# EAGLE design Frienduino (EAGLE 6.5.0)
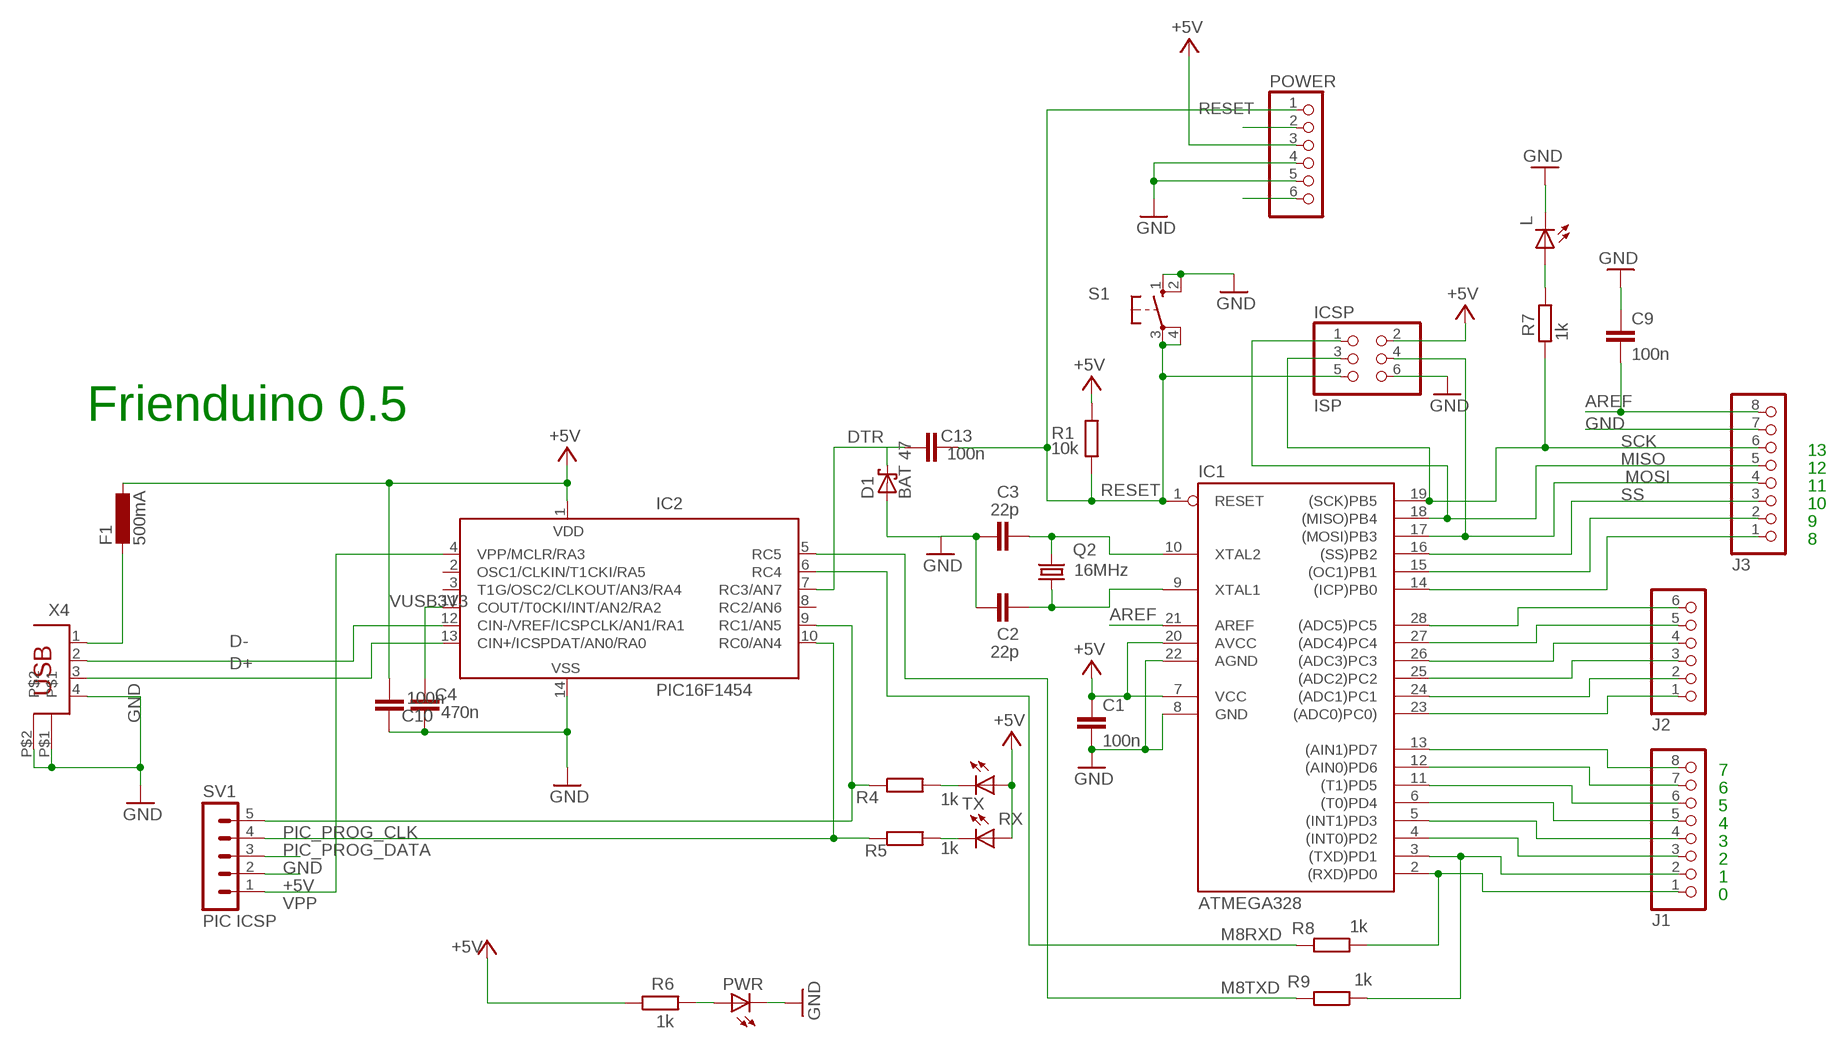
[diagram p0: schematic, sheet 1]

## Parts
C1  100n  C-EU050-025X075  [C050-025X075]
C2  22p  C-EU050-024X044  [C050-024X044]
C3  22p  C-EU050-024X044  [C050-024X044]
C4  470n  C-EU050-025X075  [C050-025X075]
C9  100n  C-EU050-025X075  [C050-025X075]
C10  100n  C-EU050-025X075  [C050-025X075]
C13  100n  C-EU050-025X075  [C050-025X075]
D1  BAT 47  SCHOTTKY-DIODEDO35-7  [DO35-7]
F1  500mA  L-EU0204/5  [0204/5]
IC1  ATMEGA328  AT90S4433P  [DIL28-3]
IC2  PIC16F1454  PIC16F676P  [DIL14]
ICSP  ISP  PINHD-2X3  [2X03]
J1  PINHD-1X8  [1X08]
J2  PINHD-1X6  [1X06]
J3  PINHD-1X8  [1X08]
L  LED3MM  [LED3MM]
POWER  PINHD-1X6  [1X06]
PWR  LED3MM  [LED3MM]
Q2  16MHz  CRYTALHC49S  [HC49/S]
R1  10k  R-EU_0204/7  [0204/7]
R4  1k  R-EU_0204/7  [0204/7]
R5  1k  R-EU_0204/7  [0204/7]
R6  1k  R-EU_0204/7  [0204/7]
R7  1k  R-EU_0204/7  [0204/7]
R8  1k  R-EU_0204/7  [0204/7]
R9  1k  R-EU_0204/7  [0204/7]
RX  LED3MM  [LED3MM]
S1  10-XX  [B3F-10XX]
SV1  PIC ICSP  MA05-1  [MA05-1]
TX  LED3MM  [LED3MM]
X4  PN61729  [PN61729]

## Nets
+5V [usbvcc]: C1.1 C10.1 F1.1 IC1.7(VCC) IC1.20(AVCC) IC2.1(VDD) ICSP.2 POWER.3 R1.2 R6.1 RX.A SV1.2 TX.A
AREF [aref]: C9.2 IC1.21(AREF) J3.8
D+: IC2.13(CIN+/ICSPDAT/AN0/RA0) X4.3
D-: IC2.12(CIN-/VREF/ICSPCLK/AN1/RA1) X4.2
DTR: C13.1 D1.C IC2.7(RC3/AN7)
GND [gnd]: C1.2 C2.1 C3.1 C4.1 C9.1 C10.2 D1.A IC1.8(GND) IC1.22(AGND) IC2.14(VSS) ICSP.6 J3.7 L.K(C) POWER.4 POWER.5 PWR.K(C) S1.1(S) S1.2(S1) SV1.3 X4.4 X4.P$1 X4.P$2
M8RXD: IC2.6(RC4) R8.2
M8TXD: IC2.5(RC5) R9.2
MISO: IC1.18((MISO)PB4) ICSP.1 J3.5
MOSI: IC1.17((MOSI)PB3) ICSP.4 J3.4
N$2: L.A R7.1
N$3: PWR.A R6.2
N$4: R4.2 TX.K(C)
N$5: IC1.14((ICP)PB0) J3.1
N$6: C2.2 IC1.9(XTAL1) Q2.1
N$7: C3.2 IC1.10(XTAL2) Q2.2
N$8 [usbvcc]: F1.2 X4.1
N$9: R5.2 RX.K(C)
N$10: IC1.4((INT0)PD2) J1.3
N$11: IC1.5((INT1)PD3) J1.4
N$12: IC1.6((T0)PD4) J1.5
N$13: IC1.11((T1)PD5) J1.6
N$14: IC1.12((AIN0)PD6) J1.7
N$15: IC1.13((AIN1)PD7) J1.8
N$16: IC1.23((ADC0)PC0)) J2.1
N$17: IC1.24((ADC1)PC1) J2.2
N$18: IC1.25((ADC2)PC2) J2.3
N$19: IC1.26((ADC3)PC3) J2.4
N$20: IC1.27((ADC4)PC4) J2.5
N$21: IC1.28((ADC5)PC5) J2.6
N$22: IC1.15((OC1)PB1) J3.2
NC@1: POWER.2
NC@2: POWER.6
PD0: IC1.2((RXD)PD0) J1.1 R8.1
PD1: IC1.3((TXD)PD1) J1.2 R9.1
PIC_PROG_CLK: IC2.9(RC1/AN5) R4.1 SV1.5
PIC_PROG_DATA: IC2.10(RC0/AN4) R5.1 SV1.4
RESET: C13.2 IC1.1(RESET) ICSP.5 POWER.1 R1.1 S1.3(P) S1.4(P1)
SCK: IC1.19((SCK)PB5) ICSP.3 J3.6 R7.2
SS: IC1.16((SS)PB2) J3.3
VPP: IC2.4(VPP/MCLR/RA3) SV1.1
VUSB3V3: C4.2 IC2.11(COUT/T0CKI/INT/AN2/RA2)
Unconnected: IC2.2(OSC1/CLKIN/T1CKI/RA5) IC2.3(T1G/OSC2/CLKOUT/AN3/RA4) IC2.8(RC2/AN6)

## Notes on the sheet
- Frienduino 0.5
- 13
- 12
- 11
- 10
- 9
- 8
- 7
- 6
- 5
- 4
- 3
- 2
- 1
- 0

## Library data of the parts
C1-C4 C9 C10 C13 = rcl:C-EU: CAPACITOR, European symbol
D1 = diode:SCHOTTKY-DIODE: Schottky Diode
F1 = rcl:L-EU: INDUCTOR, European symbol
IC1 = atmel:AT90S4433: MICROCONTROLLER 4 Kbytes FLASH 128 bytes SRAM 256 bytes EEPROM UART 6-channel 10 bit ADC
IC2 = microchip:PIC16F676: 14-Pin, Flash-Based 8-Bit CMOS Microcontroller High Performance RISC CPU: * Only 35 instructions to learn - All single-cycle instructions except branches * Operating speed: - DC - 20 MHz oscillator/clock input - DC - 200 ns instruction cycle * Internal and external oscillator options - Precision Internal 4 MHz oscillator factory calibrated to ±1% - External Oscillator support for crystals and resonators - 5?s wake-up from SLEEP, 3.0V, typical * Power saving SLEEP mode * Wide operating voltage range - 2.0V to 5.5V * Industrial and Extended temperature range * Low power Power-on Reset (POR) * Power-up Timer (PWRT) and Oscillator Start-up Timer (OST) * Brown-out Detect (BOD) * Watchdog Timer (WDT) with independent oscillator for reliable operation * Multiplexed MCLR/Input-pin * Interrupt-on-pin change * Individual programmable weak pull-ups * Programmable code protection * High Endurance FLASH/EEPROM Cell - 100,000 write FLASH endurance - 1,000,000 write EEPROM endurance - FLASH/Data EEPROM Retention: > 40 years * Standby Current: - 1 nA @ 2.0V, typical * Operating Current: - 8.5?A @ 32 kHz, 2.0V, typical - 100?A @ 1 MHz, 2.0V, typical * Watchdog Timer Current - 300 nA @ 2.0V, typical * Timer1 oscillator current: - 4?A @ 32 kHz, 2.0V, typical * 12 I/O pins with individual direction control * High current sink/source for direct LED drive * Analog-to-Digital Converter module (PIC16F676): - 10-bit resolution - Programmable 8-channel input - Voltage reference input * In-Circuit Serial ProgrammingTM (ICSPTM) via two pins Source: http://ww1.microchip.com/downloads/en/DeviceDoc/40039E.pdf; MF: MICROCHIP; MPN: PIC16F676-I/P; OC_FARNELL: 9760512; OC_NEWARK: 54K2829
ICSP = pinhead:PINHD-2X3: PIN HEADER
J1 J3 = pinhead:PINHD-1X8: PIN HEADER
J2 POWER = pinhead:PINHD-1X6: PIN HEADER
L PWR RX TX = led:LED: LED OSRAM: - CHIPLED LG R971, LG N971, LY N971, LG Q971, LY Q971, LO R971, LY R971 LH N974, LH R974 LS Q976, LO Q976, LY Q976 LO Q996 - Hyper CHIPLED LW Q18S LB Q993, LB Q99A, LB R99A - SideLED LS A670, LO A670, LY A670, LG A670, LP A670 LB A673, LV A673, LT A673, LW A673 LH A674 LY A675 LS A676, LA A676, LO A676, LY A676, LW A676 LS A679, LY A679, LG A679 - Hyper Micro SIDELED® LS Y876, LA Y876, LO Y876, LY Y876 LT Y87S - SmartLED LW L88C, LW L88S LB L89C, LB L89S, LG L890 LS L89K, LO L89K, LY L89K LS L896, LA L896, LO L896, LY L896 - TOPLED LS T670, LO T670, LY T670, LG T670, LP T670 LSG T670, LSP T670, LSY T670, LOP T670, LYG T670 LG T671, LOG T671, LSG T671 LB T673, LV T673, LT T673, LW T673 LH T674 LS T676, LA T676, LO T676, LY T676, LB T676, LH T676, LSB T676, LW T676 LB T67C, LV T67C, LT T67C, LS T67K, LO T67K, LY T67K, LW E67C LS E67B, LA E67B, LO E67B, LY E67B, LB E67C, LV E67C, LT E67C LW T67C LS T679, LY T679, LG T679 LS T770, LO T770, LY T770, LG T770, LP T770 LB T773, LV T773, LT T773, LW T773 LH T774 LS E675, LA E675, LY E675, LS T675 LS T776, LA T776, LO T776, LY T776, LB T776 LHGB T686 LT T68C, LB T68C - Hyper Mini TOPLED® LB M676 - Mini TOPLED Santana® LG M470 LS M47K, LO M47K, LY M47K Source: http://www.osram.convergy.de/
Q2 = crystal:CRYTAL: CRYSTAL
R1 R4-R9 = resistor:R-EU_: RESISTOR, European symbol
S1 = switch-omron:10-XX: OMRON SWITCH
SV1 = con-lstb:MA05-1: PIN HEADER; OC_FARNELL: unknown; OC_NEWARK: unknown
X4 = SmartPrj:PN61729: BERG USB connector

## Net classes
0 default: width 0.254 mm, drill 0.305 mm, clearance 0.152 mm
1 power: width 0.406 mm, drill 0.508 mm, clearance 0.152 mm
2 gnd: width 0.305 mm, drill 0.508 mm, clearance 0.152 mm
3 usbvcc: width 0.406 mm, drill 0.508 mm, clearance 0.152 mm
4 aref: width 0.406 mm

## Board
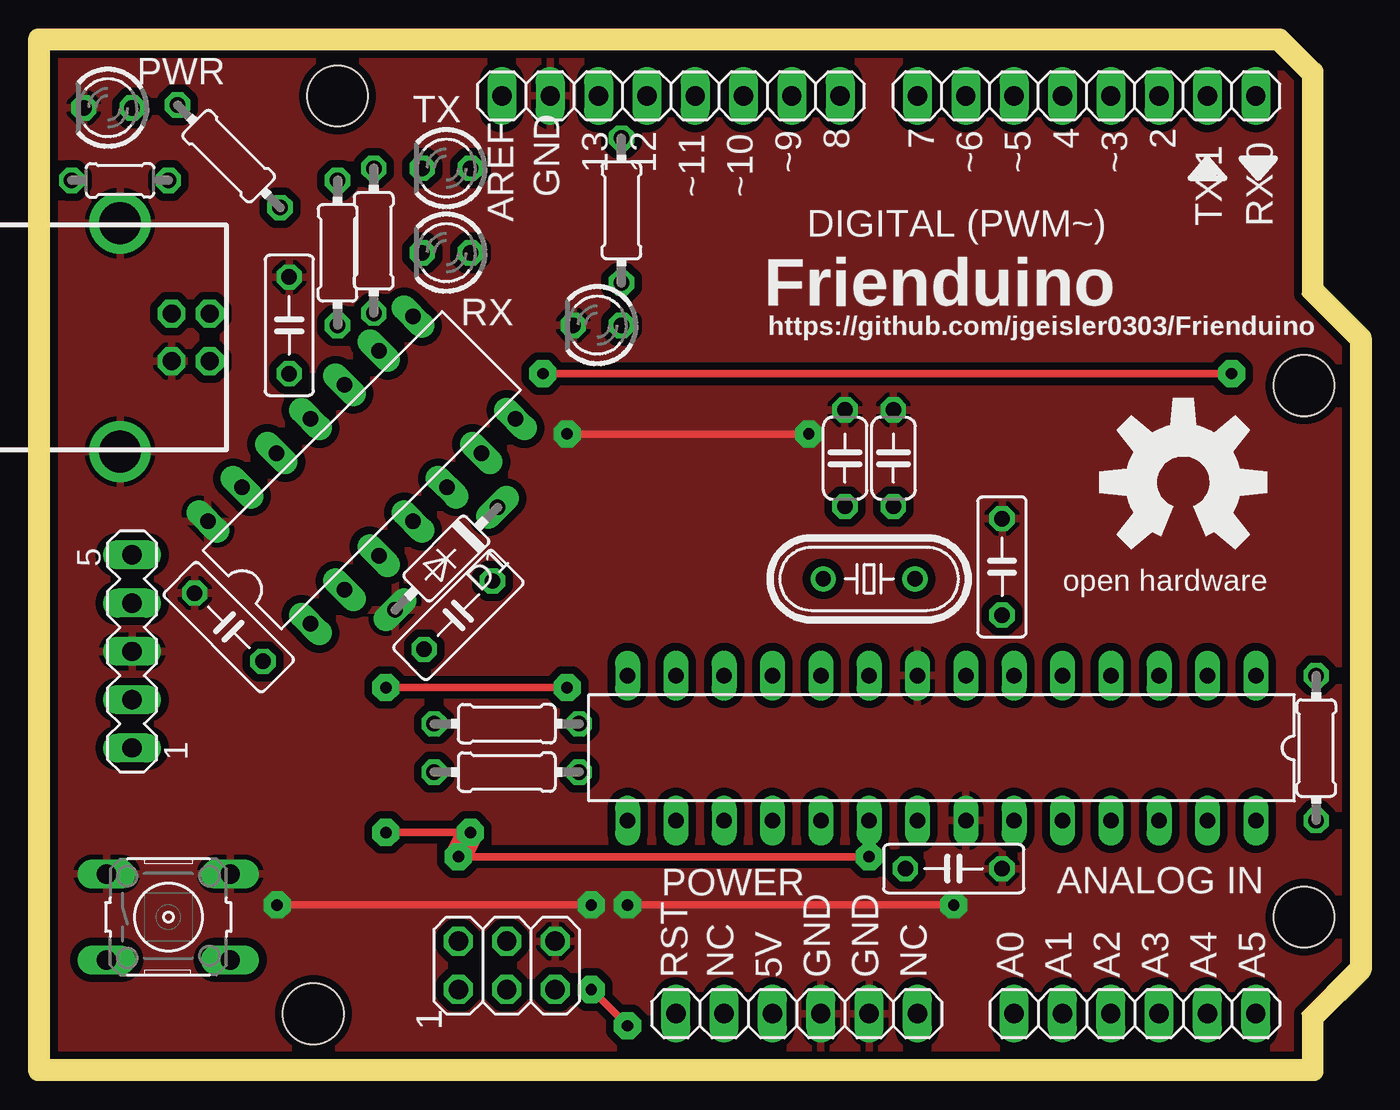
[diagram p1: board, top side]
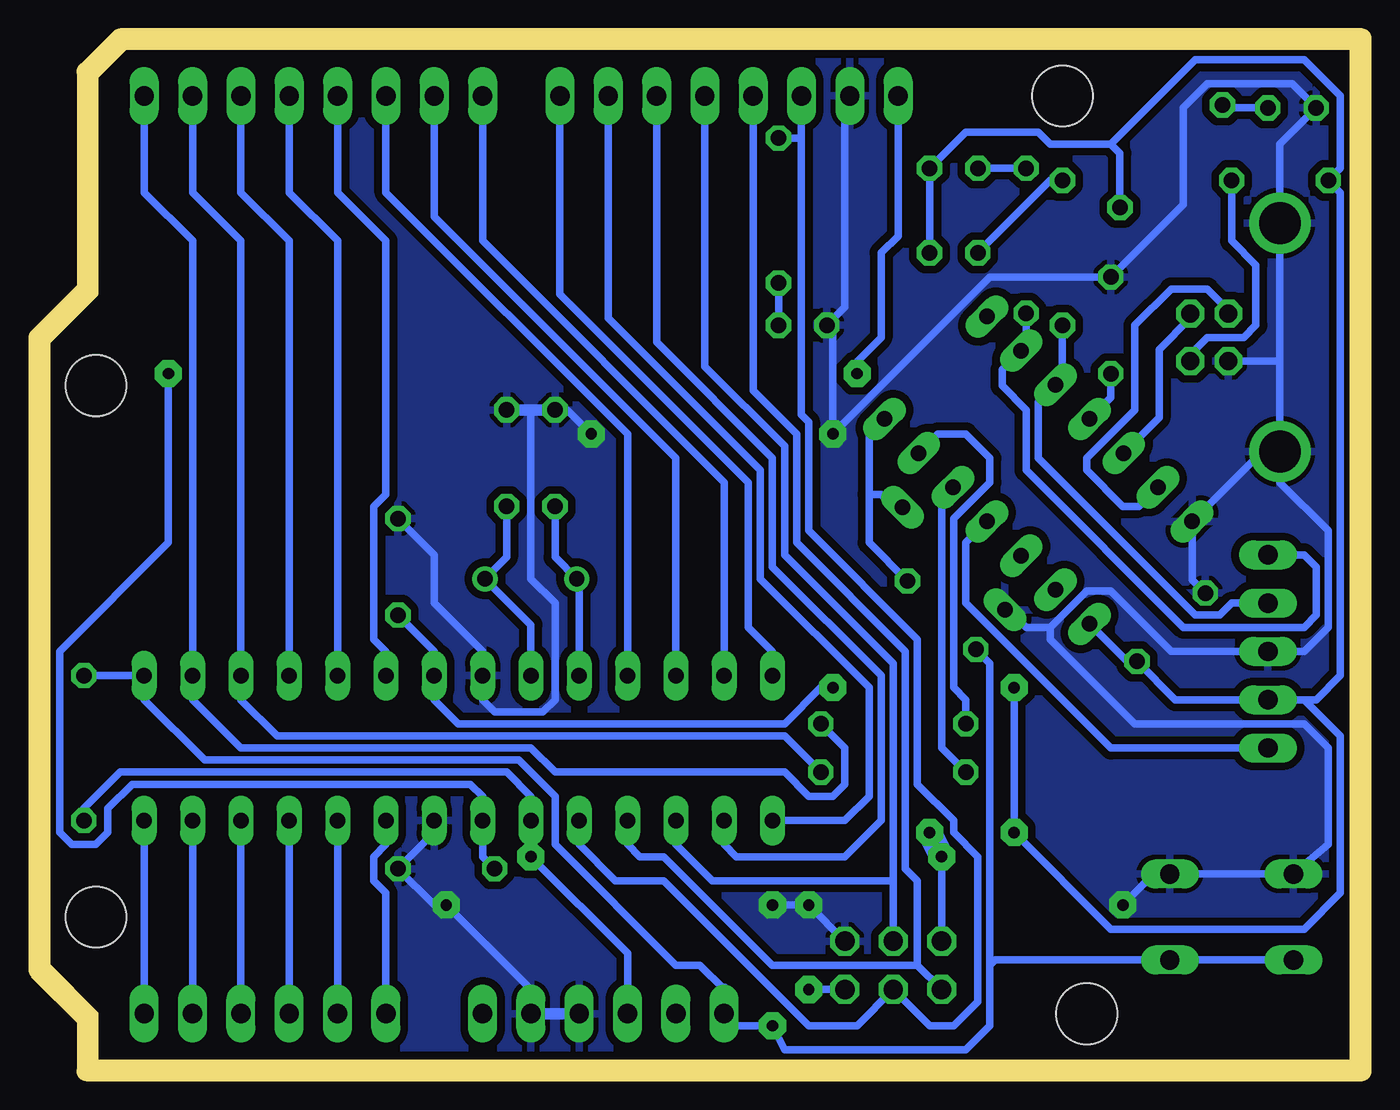
[diagram p2: board, bottom side, seen from below]

Size 68.58 x 53.34 mm. Coordinates in mm from the lower left corner, seen from the top.
Outline: 0,53.34 64.52,53.34 66.04,51.82 66.04,40.39 68.58,37.85 68.58,5.08 66.04,2.54 66.04,0 0,0 0,53.34
Copper layers (1*16): Top 0.035mm / dielectric 1.5mm / Bottom 0.035mm
Design rules "SeeedStudio_2layer_DRU_no_angle_20140221": minimum track width 6mil, minimum drill 12mil, track to track 6mil, track to pad 6mil, pad to pad 6mil, via to via 6mil, smd to smd 0mil, copper to edge 10mil, drill to drill 10mil, minimum pad ring 10mil, minimum via ring 6mil, stop-mask expansion 2mil, vias tented up to drill 100mil, thermal gap 10mil
Holes 3.2 mm at 66.04,35.56 66.04,7.62 15.24,50.8 13.97,2.54
Milling: 9 lines

### Footprints (pad centres in the part's own frame; a part is rotated, then mirrored left to right if it is on the bottom)
C050-025X075 = drill 0.813 octagon: 1 -2.54,0; 2 2.54,0
C050-024X044 = drill 0.813 octagon: 1 -2.54,0; 2 2.54,0
DO35-7 = drill 0.813 long: A 3.81,0; C -3.81,0
0204/5 = drill 0.813 octagon: 1 -2.54,0; 2 2.54,0
DIL28-3 = drill 0.813 long: 1 -16.51,-3.81; 2 -13.97,-3.81; 3 -11.43,-3.81; 4 -8.89,-3.81; 5 -6.35,-3.81; 6 -3.81,-3.81; 7 -1.27,-3.81; 8 1.27,-3.81; 9 3.81,-3.81; 10 6.35,-3.81; 11 8.89,-3.81; 12 11.43,-3.81; 13 13.97,-3.81; 14 16.51,-3.81; 15 16.51,3.81; 16 13.97,3.81; 17 11.43,3.81; 18 8.89,3.81; 19 6.35,3.81; 20 3.81,3.81; 21 1.27,3.81; 22 -1.27,3.81; 23 -3.81,3.81; 24 -6.35,3.81; 25 -8.89,3.81; 26 -11.43,3.81; 27 -13.97,3.81; 28 -16.51,3.81
DIL14 = drill 0.813 long: 1 -7.62,-3.81; 2 -5.08,-3.81; 3 -2.54,-3.81; 4 0,-3.81; 5 2.54,-3.81; 6 5.08,-3.81; 7 7.62,-3.81; 8 7.62,3.81; 9 5.08,3.81; 10 2.54,3.81; 11 0,3.81; 12 -2.54,3.81; 13 -5.08,3.81; 14 -7.62,3.81
2X03 = drill 1.016 octagon: 1 -2.54,-1.27; 2 -2.54,1.27; 3 0,-1.27; 4 0,1.27; 5 2.54,-1.27; 6 2.54,1.27
1X08 = drill 1.016 long: 1 -8.89,0; 2 -6.35,0; 3 -3.81,0; 4 -1.27,0; 5 1.27,0; 6 3.81,0; 7 6.35,0; 8 8.89,0
1X06 = drill 1.016 long: 1 -6.35,0; 2 -3.81,0; 3 -1.27,0; 4 1.27,0; 5 3.81,0; 6 6.35,0
LED3MM = drill 0.813 octagon: A -1.27,0; K 1.27,0
HC49/S = drill 0.813: 1 -2.413,0; 2 2.413,0
0204/7 = drill 0.813 octagon: 1 -3.81,0; 2 3.81,0
B3F-10XX = drill 1.016 long: 1 -3.251,2.261; 2 3.251,2.261; 3 -3.251,-2.261; 4 3.251,-2.261
MA05-1 = drill 1.016 long: 1 -5.08,0; 2 -2.54,0; 3 0,0; 4 2.54,0; 5 5.08,0
PN61729 = drill 0.95 octagon: 1 1.25,4.71; 2 -1.25,4.71; 3 -1.25,2.71; 4 1.25,2.71 | drill 2.2: P$1 -6,0; P$2 6,0

### Placement (x,y rotation side)
C1  50.16,26.04 90 top
C2  44.45,31.75 270 top
C3  41.91,31.75 270 top
C4  12.7,38.73 270 top
C9  47.62,10.16 180 top
C10  9.53,22.86 135 top
C13  21.59,23.5 225 top
D1  20.96,26.47 225 top
F1  3.81,46.35 0 top
IC1  46.99,16.51 180 top
IC2  16.51,31.11 45 top
ICSP  24.13,5.08 0 top
J1  54.61,50.8 180 top
J2  57.15,2.54 0 top
J3  32.77,50.8 180 top
L  28.89,38.73 180 top
POWER  39.37,2.54 0 top
PWR  3.17,50.16 180 top
Q2  43.18,25.4 180 top
R1  66.67,16.51 270 top
R4  17.14,43.18 90 top
R5  15.24,42.55 90 top
R6  9.53,47.62 135 top
R7  30.16,44.77 90 top
R8  24.13,17.78 180 top
R9  24.13,15.24 180 top
RX  20.95,42.55 180 top
S1  6.35,7.62 0 top
SV1  4.45,21.59 90 top
TX  20.95,46.99 180 top
X4  3.81,38.1 270 top

### Tracks (layer width: path | path; a pad name or v marks a point on that pad's centre or on a via)
+5V  (via drill 0.6 pad 1.42)
  Top 0.406: v27.3,19.68 v17.78,19.68 | v22.23,12.06 v17.78,12.06 | v43.18,10.79 v21.59,10.79
  Top 1.422: v21.59,10.79 v22.23,12.06
  Bottom 0.406: 2.54,19.05 1.91,19.05 0.64,20.32 0.64,45.72 F1.1 0.64,46.99 0.64,50.8 2.54,52.7 8.26,52.7 12.7,48.26 | 2.54,19.05 SV1.2 9.31,19.05 C10.1 11.85,21.06 IC2.1 | v27.3,19.68 27.94,19.68 29.84,17.78 46.99,17.78 48.26,19.05 IC1.7 48.26,21.59 C1.1 | 2.54,19.05 0.64,17.14 0.64,8.89 2.54,6.99 12.7,6.99 v17.78,12.06 v17.78,19.68 | ICSP.2 v21.59,10.79 | POWER.3 38.1,5.71 v43.18,10.79 IC1.20 43.18,13.97 44.45,15.24 64.77,15.24 66.67,13.34 R1.2 | RX.A TX.A 20.32,48.9 16.51,48.9 15.88,48.26 12.7,48.26 | R6.1 12.22,47.78 12.7,48.26
  Bottom 1.27: v21.59,10.79 v22.23,12.06
AREF  (via drill 0.6 pad 1.42)
  Top 0.406: v26.04,36.2 v62.23,36.2
  Bottom 0.406: J3.8 23.88,43.43 24.77,42.55 24.77,38.1 26.04,36.83 v26.04,36.2 | v62.23,36.2 62.23,27.3 67.94,21.59 67.94,12.06 67.31,11.43 66.04,11.43 65.41,12.06 65.41,13.34 64.14,14.61 46.35,14.61 45.72,13.97 IC1.21 45.72,10.79 C9.2
D+
  Bottom 0.406: X4.3 6.52,39.54 7.62,40.64 9.53,40.64 11.43,38.73 11.43,34.29 13.97,31.75 13.97,31.11 12.06,29.21 11.23,29.21 IC2.13
D-
  Bottom 0.406: X4.2 8.52,39.1 10.16,37.47 10.16,33.87 IC2.12
DTR
  Bottom 0.406: IC2.7 24.61,33.81 25.4,33.02 25.4,29.84 | 25.4,29.84 25.4,27.3 C13.1 | D1.C 23.45,29.16 22.86,28.57 23.5,28.57 24.77,29.84 25.4,29.84
GND  (via drill 0.6 pad 1.42)
  Top 0.406: v30.48,8.26 v47.62,8.26 | v40.01,33.02 v27.3,33.02 | v28.57,8.26 v12.06,8.26
  Bottom 0.406: J3.7 26.67,50.55 26.67,39.69 L.K 27.3,38.42 v27.3,33.02 19.05,41.27 C4.1 8.89,45.09 8.89,50.16 7.62,51.44 3.17,51.44 PWR.K 3.81,48.26 X4.P$1 3.81,36.83 | X4.P$2 3.81,36.83 | X4.4 3.83,36.85 3.81,36.83 | X4.P$2 3.81,30.48 1.27,27.94 1.27,22.86 2.54,21.59 SV1.3 9.53,21.59 12.7,24.77 13.97,24.77 15.88,22.86 | X4.P$2 4.09,32.38 4.45,32.38 8.41,28.42 IC2.14 8.43,25.36 C10.2 | 43.18,34.29 43.18,25.4 41.91,24.13 41.91,19.05 42.55,18.41 45.09,18.41 45.72,19.05 IC1.8 45.72,21.59 48.26,24.13 48.26,26.67 C1.2 | 15.88,22.86 15.88,22.23 11.43,17.78 2.54,17.78 1.27,16.51 1.27,11.43 S1.1 S1.2 10.44,9.88 v12.06,8.26 | v30.48,8.26 v28.57,8.26 ICSP.6 | v40.01,33.02 41.27,34.29 C3.1 | POWER.5 43.18,3.81 v47.62,8.26 48.26,8.26 C9.1 48.26,12.06 IC1.22 | D1.A 18.06,23.77 17.14,22.86 15.88,22.86
  Bottom 0.61: POWER.4 POWER.5 | C3.1 43.18,34.29 C2.1
  pour Bottom (isolate 0.406): 0,53.34 0,0 66.04,0 66.04,2.54 68.58,5.08 68.58,38.1 66.04,40.64 66.04,51.44 64.14,53.34
  pour Top (isolate 0.406): 0,0 0,53.34 64.14,53.34 66.04,51.44 66.04,40.64 68.58,38.1 68.58,5.08 66.04,2.54 66.04,0
M8RXD
  Bottom 0.406: IC2.6 21.79,33.02 20.32,33.02 19.05,31.75 19.05,30.48 20.95,28.57 20.95,19.68 20.32,19.05 R8.2
M8TXD
  Bottom 0.406: IC2.5 21,29.8 21.59,29.21 21.59,16.51 R9.2
MISO
  Bottom 0.406: J3.5 31.5,35.31 29.21,33.02 29.21,27.3 23.5,21.59 23.5,10.16 22.86,9.53 22.86,5.08 | 22.86,5.08 ICSP.1 | 22.86,5.08 30.48,5.08 36.2,10.79 37.47,10.79 38.1,11.43 IC1.18
MOSI
  Bottom 0.406: 24.13,9.53 33.66,9.53 35.56,11.43 IC1.17 | J3.4 34.04,36.58 29.84,32.38 29.84,26.67 24.13,20.95 24.13,9.53 | 24.13,9.53 ICSP.4
N$2
  Bottom 0.406: R7.1 L.A
N$3
  Bottom 0.406: PWR.A 6.68,50.16 R6.2
N$4
  Bottom 0.406: R4.2 TX.K
N$5
  Bottom 0.406: J3.1 41.66,40.39 31.75,30.48 31.75,22.86 30.48,21.59 IC1.14
N$6
  Bottom 0.406: IC1.9 43.18,22.99 Q2.1 44.45,26.54 C2.2
N$7
  Bottom 0.406: IC1.10 40.64,25.27 Q2.2 41.91,26.54 C3.2
N$8
  Bottom 0.406: X4.1 8.52,37.2 7.62,38.1 5.71,38.1 5.08,38.73 5.08,41.91 6.35,43.18 F1.2
N$9
  Bottom 0.406: R5.2 15.88,46.35 RX.K
N$10
  Bottom 0.406: J1.3 58.42,45.72 55.88,43.18 IC1.4
N$11
  Bottom 0.406: J1.4 55.88,45.72 53.34,43.18 IC1.5
N$12
  Bottom 0.406: IC1.6 50.8,21.59 51.44,22.23 51.44,29.21 50.8,29.84 50.8,43.18 53.34,45.72 J1.5
N$13
  Bottom 0.406: IC1.11 38.1,33.02 50.8,45.72 J1.6
N$14
  Bottom 0.406: J1.7 48.26,44.45 35.56,31.75 IC1.12
N$15
  Bottom 0.406: J1.8 45.72,43.18 33.02,30.48 IC1.13
N$16
  Bottom 0.406: IC1.23 50.8,11.43 51.44,10.79 51.44,9.53 50.8,8.89 J2.1
N$17
  Bottom 0.406: IC1.24 J2.2
N$18
  Bottom 0.406: IC1.25 J2.3
N$19
  Bottom 0.406: IC1.26 J2.4
N$20
  Bottom 0.406: IC1.27 J2.5
N$21
  Bottom 0.406: IC1.28 J2.6
  Bottom 0.61: 63.6,2.64 J2.6
N$22
  Bottom 0.406: J3.2 39.12,39.12 31.11,31.11 31.11,25.4 25.4,19.68 25.4,13.97 26.67,12.7 IC1.15
PD0
  Bottom 0.406: J1.1 63.5,45.72 60.96,43.18 IC1.2 60.96,19.05 58.42,16.51 43.18,16.51 41.91,15.24 29.84,15.24 28.57,13.97 27.3,13.97 26.67,14.61 26.67,16.51 R8.1
PD1
  Bottom 0.406: J1.2 60.96,45.72 58.42,43.18 IC1.3 58.42,19.05 56.52,17.14 29.84,17.14 R9.1
PIC_PROG_CLK
  Bottom 0.406: SV1.5 2.54,26.67 1.91,26.04 1.91,23.5 2.54,22.86 8.89,22.86 17.14,31.11 17.14,34.29 18.41,35.56 18.41,36.39 IC2.9 17.14,37.66 R4.1
PIC_PROG_DATA
  Bottom 0.406: SV1.4 6.35,24.13 6.99,23.5 8.26,23.5 16.51,31.75 16.51,34.71 IC2.10 15.61,35.82 15.24,36.2 R5.1
RESET  (via drill 0.6 pad 1.42)
  Top 0.406: v28.57,3.81 v30.48,1.91
  Bottom 0.406: 33.02,3.81 34.29,5.08 35.56,5.08 41.91,11.43 41.91,13.97 43.81,15.88 60.33,15.88 63.5,19.05 IC1.1 R1.1 | 19.05,5.08 19.05,1.91 20.32,0.64 29.84,0.64 v30.48,1.91 32.38,1.91 POWER.1 | ICSP.5 v28.57,3.81 | S1.3 S1.4 18.77,5.36 19.05,5.08 | 19.05,5.08 19.05,20.95 C13.2
  Bottom 0.61: 33.02,3.81 POWER.1
SCK
  Bottom 0.406: IC1.19 40.64,11.43 38.73,9.53 36.2,9.53 28.57,1.91 26.04,1.91 ICSP.3 22.23,1.91 20.95,1.91 19.68,3.17 19.68,10.79 20.95,12.06 20.95,12.7 22.86,14.61 22.86,22.23 28.57,27.94 28.57,33.66 28.96,34.04 28.96,48.58 | J3.6 28.96,48.58 | R7.2 28.96,48.58
SS
  Bottom 0.406: J3.3 36.58,37.85 30.48,31.75 30.48,26.04 24.77,20.32 24.77,12.7 26.67,10.79 32.38,10.79 33.02,11.43 IC1.16
VPP
  Bottom 0.406: SV1.1 12.7,16.51 20.32,24.13 20.32,27.3 19.68,27.94 | 19.68,27.94 | 19.68,27.94 IC2.4
VUSB3V3
  Bottom 0.406: C4.2 12.7,34.92 IC2.11

### Text on the board
tPlace: open hardware
tNames: TX | 8 | 7 | 4 | 2 | 13 | 12 | ~9 | ~6 | ~5 | ~3 | GND | ~11 | ~10 | AREF | TX 1 | RX 0 | DIGITAL (PWM~) | Frienduino | RX | https://github.com/jgeisler0303/Frienduino | ANALOG IN | RST | NC | 5V | GND | GND | NC | A0 | A1 | A2 | A3 | A4 | A5 | 1
Reference: R7 | R5 | R6 | R4 | C3 | C2 | R9 | R8 | R1 | R2 | C1